# Altium schematic sheet Isolation.SchDoc
size A
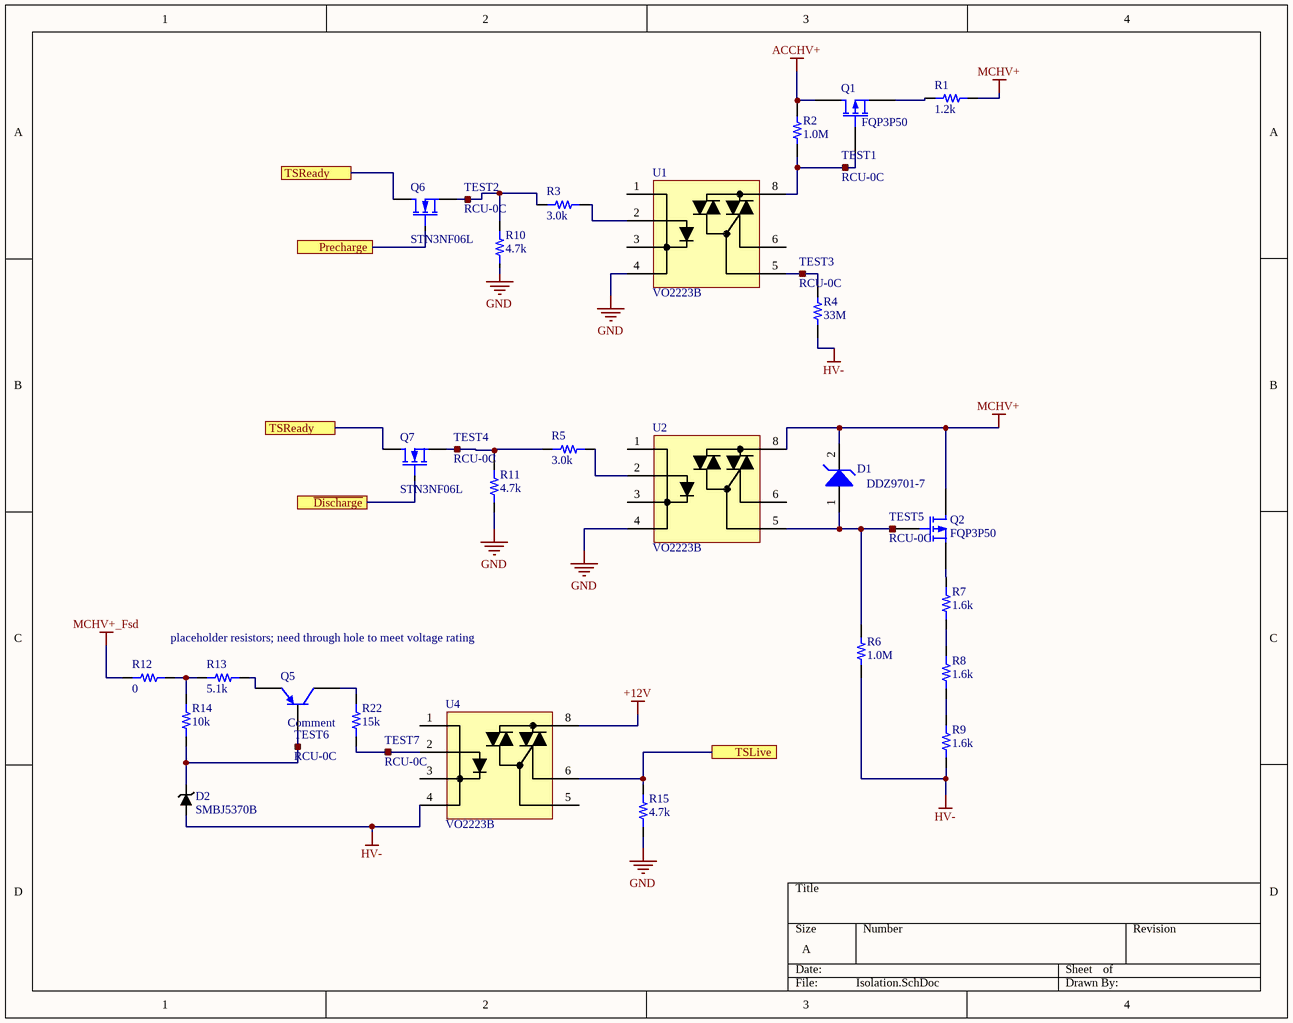
[diagram p0: Isolation.SchDoc]

## Parts
D1  DDZ9701-7  [SOD123F]
D2  SMBJ5370B  [SMBJ5370B-TP]
Q1  FQP3P50  [TO-220AB]
Q2  FQP3P50  [TO-220AB]
Q5  Comment  [TO-92 (TO-226)]
Q6  STN3NF06L  [STN3NF06L]
Q7  STN3NF06L  [STN3NF06L]
R1  value 1.2k  [AP101]  (hidden comment: Resistor 1k2 100W 1% Throughhole)
R2  value 1.0M  [RES 0603/1608]  (hidden comment: Resistor 1.0M 0603 1/10W 10%)
R3  value 3.0k  [RES 0603/1608]  (hidden comment: Resistor 3.0k 0603 1/10W 1%)
R4  value 33M  [RES 0603/1608]  (hidden comment: Resistor 33M 0603 1/10W 10%)
R5  value 3.0k  [RES 0603/1608]  (hidden comment: Resistor 3.0k 0603 1/10W 1%)
R6  value 1.0M  [RES 0603/1608]  (hidden comment: Resistor 1.0M 0603 1/10W 1%)
R7  value 1.6k  [Axial 52mm Pitch]  (hidden comment: Resistor 1.6k Axial 10W 5%)
R8  value 1.6k  [Axial 52mm Pitch]  (hidden comment: Resistor 1.6k Axial 10W 5%)
R9  value 1.6k  [Axial 52mm Pitch]  (hidden comment: Resistor 1.6k Axial 10W 5%)
R10  value 4.7k  [RES 0603/1608]  (hidden comment: Resistor 4.7k 0603 1/10W 5%)
R11  value 4.7k  [RES 0603/1608]  (hidden comment: Resistor 4.7k 0603 1/10W 5%)
R12  value 0  [PR02]  (hidden comment: Resistor 2W TH)
R13  value 5.1k  [PR02]  (hidden comment: Resistor 2W TH)
R14  value 10k  [PR02]  (hidden comment: Resistor 2W TH)
R15  value 4.7k  [RES 0603/1608]  (hidden comment: Resistor 4.7k 0603 1/10W 5%)
R22  value 15k  [PR02]  (hidden comment: Resistor 2W TH)
TEST1  RCU-0C  [RCU-0C]
TEST2  RCU-0C  [RCU-0C]
TEST3  RCU-0C  [RCU-0C]
TEST4  RCU-0C  [RCU-0C]
TEST5  RCU-0C  [RCU-0C]
TEST6  RCU-0C  [RCU-0C]
TEST7  RCU-0C  [RCU-0C]
U1  VO2223B  [Option 7]
U2  VO2223B  [Option 7]
U4  VO2223B  [Option 7]

## Ports
Precharge, TSLive, TSReady, ~{Discharge}

## Nets
+12V: U4.8
ACCHV+: Q1.2(D) R2.1
GND: R10.1 R11.1 R15.1 U1.4 U2.4
HV-: D2.1 R4.1 R6.1 R9.1 U4.4
MCHV+: D1.2(K) Q2.2(D) R1.2 U2.8
MCHV+_Fsd: R12.1
~{Discharge}: Q7.1(G) ; port ~{Discharge}
Precharge: Q6.1(G) ; port Precharge
TSLive: R15.2 U4.6 ; port TSLive
TSReady: Q6.2(D) Q7.2(D) ; port TSReady
NetD1_1: D1.1(A) Q2.1(G) R6.2 TEST5.1 U2.5
NetD2_2: D2.2 Q5.1(B) R14.1 TEST6.1
NetQ1_1: Q1.1(G) R2.2 TEST1.1 U1.8
NetQ1_3: Q1.3(S) R1.1
NetQ2_3: Q2.3(S) R7.2
NetQ5_2: Q5.2(E) R13.2
NetQ5_3: Q5.3(C) R22.2
NetQ6_3: Q6.3(S) R3.1 R10.2 TEST2.1
NetQ7_3: Q7.3(S) R5.1 R11.2 TEST4.1
NetR3_2: R3.2 U1.2
NetR4_2: R4.2 TEST3.1 U1.5
NetR5_2: R5.2 U2.2
NetR7_1: R7.1 R8.2
NetR8_1: R8.1 R9.2
NetR12_2: R12.2 R13.1 R14.2
NetR22_1: R22.1 TEST7.1 U4.2

Not connected (* = marked no-connect by the designer): U1 1 3 6; U2 1 3 6; U4 1 3 5

## Notes on the sheet
- placeholder resistors; need through hole to meet voltage rating

## Library data of the parts
D1 = 10: Zener Diode 14V 500mW ±5% Surface Mount SOD-123; Manufacturer_id: 8; idDiode: 10; Drawer_id: 1; Value: 14Vz; MfrPartNo: DDZ9701-7; Name: DDZ9701; Type: Zener; Num_Circuits: 1; Power: 500mW; Package: SOD-123; Link: https://www.digikey.com/product-detail/en/diodes-incorporated/DDZ9701-7/DDZ9701-7DICT-ND/3877402; ComponentLink1Description: Datasheet; ComponentLink1URL: https://www.diodes.com/assets/Datasheets/ds30410.pdf; Supplier1: Digi-Key; Supplier1PartNo: DDZ9701-7DICT-ND
D2 = 13: 56V Zener Diode; Manufacturer_id: 1; idDiode: 13; Created_By: Graydon; Drawer_id: 1; Name: SMBJ5370B-TP; Value: 56V; Type: Zener; Num_Circuits: 1; Link: https://www.digikey.com/product-detail/en/micro-commercial-co/SMBJ5370B-TP/SMBJ5370B-TPMSCT-ND/3165257; ComponentLink1Description: Digikey; ComponentLink1URL: https://www.digikey.com/product-detail/en/micro-commercial-co/SMBJ5370B-TP/SMBJ5370B-TPMSCT-ND/3165257; Supplier1: Digikey; Supplier1PartNo: SMBJ5370B-TPMSCT-ND
Q1 Q2 = 5: Manufacturer_id: 1; idFETs: 5; Value: P_Channel; Vdss: 500V; Id: 2.7A; Rds_On: 4Ohms; Vgs(typ): 4.0v; Vgs(Max): 5.0V; Power(Max): 85W; Created_By: Angel; Drawer_id: 1; Name: FQP3P50; Num_Circuits: 1; Package: TO-220; MfrPartNo: FQP3P50; Link: https://www.digikey.com/product-detail/en/on-semiconductor/FQP3P50/FQP3P50-ND/1055021; Supplier1: Digi-Key; Supplier1PartNo: FQP3P50-ND
Q5 = 1: idBJT: 1; Name: MPSA56; Value: .5A; Type: PNP; hFE: 100; Created_By: Angel Delgado; Manufacturer_id: 1; Drawer_id: 1; Created_Date: 6/10/2018
Q6 Q7 = 8: MOSFET N-CH 60V 4A SOT223; Manufacturer_id: 1; idFETs: 8; Value: N_Channel; Rds_On: 70m; Vgs(Max): +/- 16V; Power(Max): 3.3W; Created_By: Graydon; Drawer_id: 1; Name: STN3NF06L; Vdss: 60V; Num_Circuits: 1; Id: 4A; Package: SOT-233; MfrPartNo: STN3NF06L; Link: https://www.digikey.com/product-detail/en/stmicroelectronics/STN3NF06L/497-3177-1-ND/654516; ComponentLink1Description: Datasheet; ComponentLink1URL: https://www.st.com/content/ccc/resource/technical/document/datasheet/b1/52/93/f0/a9/a9/40/d7/CD00002430.pdf/files/CD00002430.pdf/jcr:content/translations/en.CD00002430.pdf; Supplier1: Digkey; Supplier1PartNo: 497-3177-1-ND; Created_Date: 11/26/2018
R1 = 2705: 100W Throughhole Resistor; Manufacturer_id: 1; idResistor: 2705; Name: AP101 1K2 J; Tolerance: 5%; Created_By: Graydon; Supplier 1: Digi-Key; Supplier Part Number 1: AP1011K2J-ND; Drawer_id: 1; Power: 100W; Package: TO-247-2; MfrPartNo: AP101 1K2 J; Link: https://www.digikey.com/short/jvdcjz; ComponentLink1Description: Datasheet; ComponentLink1URL: https://www.ohmite.com/assets/docs/acl_ap101.pdf?r=false; Created_Date: 2018-11-24
R2 = 2341: Manufacturer_id: 1; idResistor: 2341; Name: Res_1.0M_0603_1/10W_10%; Created_By: Nick Mah; Supplier 1: Digi-Key; Drawer_id: 1; Tolerance: 10%; Power: 1/10W; Package: 0603; ComponentLink1Description: Datasheet; Created_Date: 2018-10-20
R3 R5 = 300: Manufacturer_id: 1; idResistor: 300; Name: Res_3.0k_0603_1/10W_1%; Created_By: Nick Mah; Supplier 1: Digi-Key; Drawer_id: 1; Tolerance: 1%; Power: 1/10W; Package: 0603; ComponentLink1Description: Datasheet; Created_Date: 2018-10-20
R4 = 2359: Manufacturer_id: 1; idResistor: 2359; Name: Res_33M_0603_1/10W_10%; Created_By: Nick Mah; Supplier 1: Digi-Key; Drawer_id: 1; Tolerance: 10%; Power: 1/10W; Package: 0603; ComponentLink1Description: Datasheet; Created_Date: 2018-10-20
R6 = 361: Manufacturer_id: 1; idResistor: 361; Name: Res_1.0M_0603_1/10W_1%; Created_By: Nick Mah; Supplier 1: Digi-Key; Drawer_id: 1; Tolerance: 1%; Power: 1/10W; Package: 0603; ComponentLink1Description: Datasheet; Created_Date: 2018-10-20
R7-R9 = 2706: Manufacturer_id: 1; MfrPartNo: SQP10AJB-1K6; idResistor: 2706; Name: Res_1.6k_Axial_10W_5%; Supplier 1: Digi-Key; Supplier Part Number 1: Digi-Key; Drawer_id: 1; Tolerance: 5%; Power: 10W; Package: Axial; Link: https://www.digikey.com/product-detail/en/yageo/SQP10AJB-1K6/1.6KW-10-ND/18787; ComponentLink1Description: Datasheet
R10 R11 R15 = 1385: Manufacturer_id: 1; idResistor: 1385; Name: Res_4.7k_0603_1/10W_5%; Created_By: Nick Mah; Supplier 1: Digi-Key; Drawer_id: 1; Tolerance: 5%; Power: 1/10W; Package: 0603; ComponentLink1Description: Datasheet; Created_Date: 2018-10-20
R12-R14 R22 = 2707: 2W TH resistor; Manufacturer_id: 1; idResistor: 2707; Tolerance: 5%; Created_By: Graydon; Supplier Part Number 1: Digi-Key; Drawer_id: 1; Name: PR02; Power: 2W; Package: Axial; Link: https://www.digikey.com/products/en/resistors/through-hole-resistors/53?FV=ffec4976; ComponentLink1Description: Datasheet; Created_Date: 2018-12-01
TEST1-TEST7 = 14: Test point; Manufacturer_id: 1; idConn: 14; Value: CONN; Created_By: Graydon; Updated_By: Null; Drawer_id: 1; Name: RCU-0C; Num_Contacts: 1; Num_Rows: 1; Package: RCU-0C; MfrPartNo: RCU-0C; Link: https://www.digikey.com/product-detail/en/te-connectivity-amp-connectors/RCU-0C/A106145CT-ND/3477802; ComponentLink1Description: Null; ComponentLink1URL: Null; Supplier1: None; Supplier1PartNo: None; Created_Date: 11/10/2018
U1 U2 U4 = 19: Optocoupler, Power Phototriac; Manufacturer_id: 1; idIC_Misc: 19; Name: VO2223B Optocoupler; Drawer_id: 1